# EAGLE design IRTHERMV2.1 (EAGLE 7.2.0)
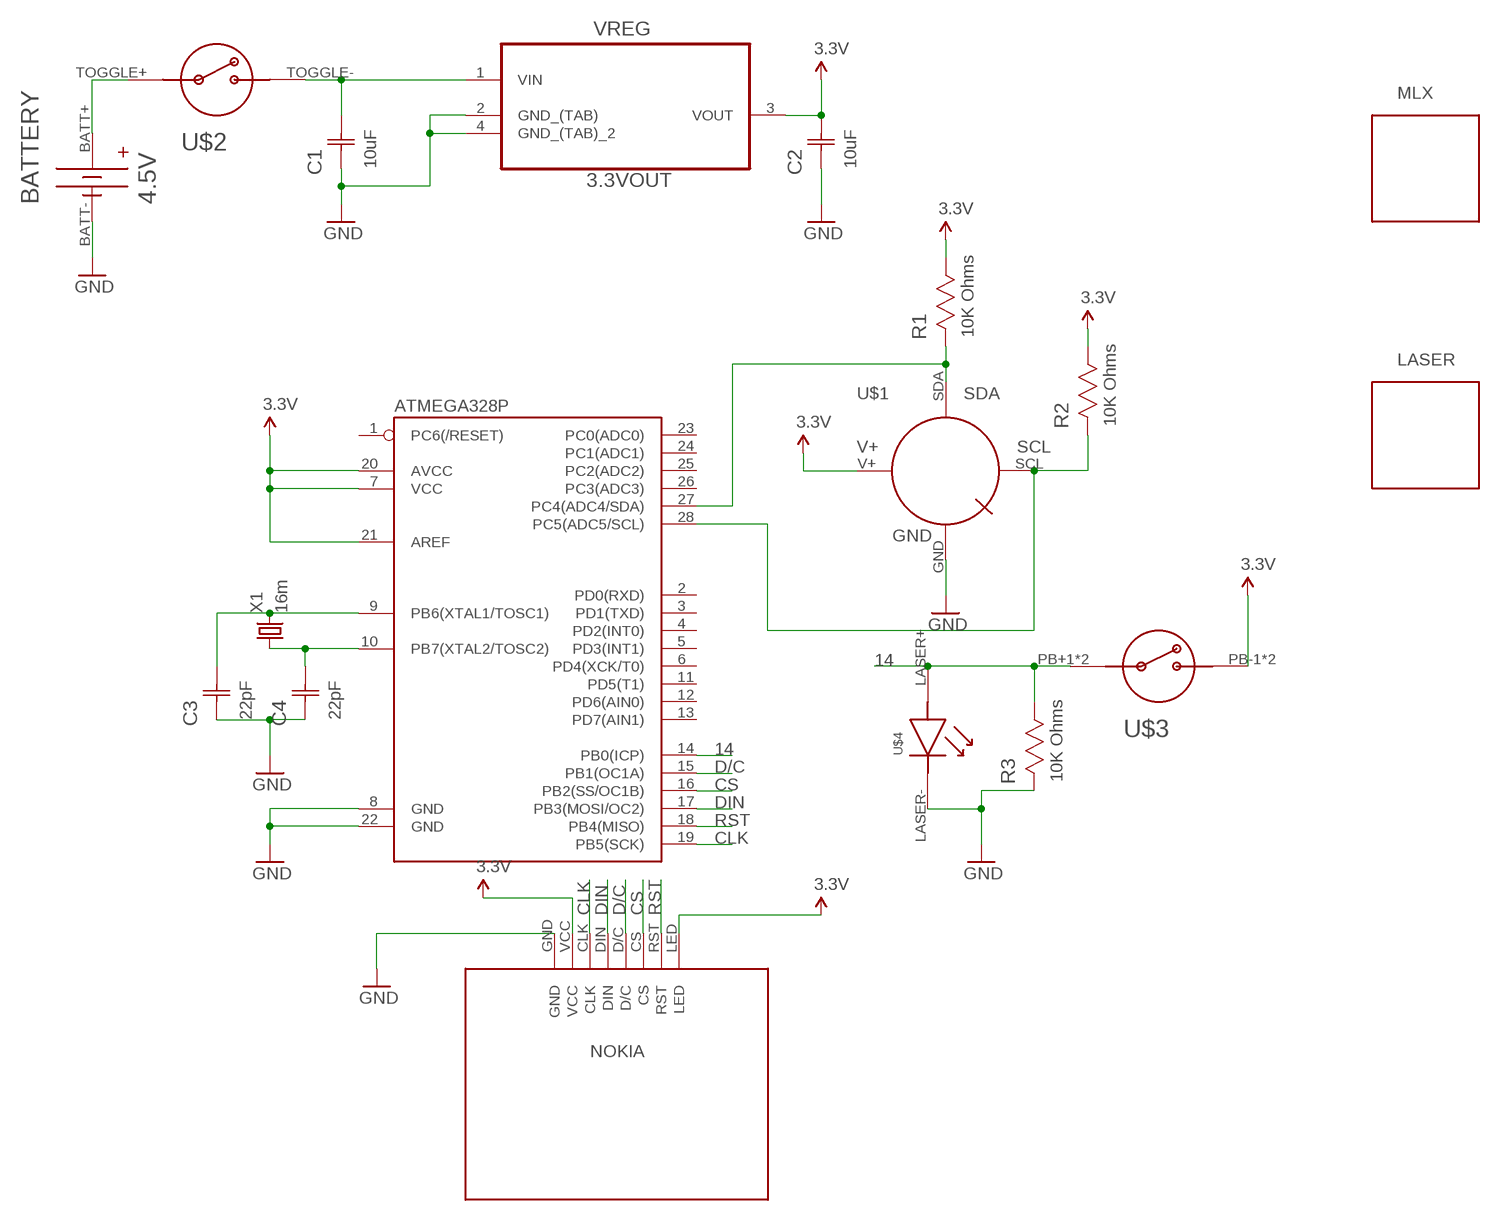
[diagram p0: schematic, sheet 1]

## Parts
ATMEGA328P  ATMEGA328P_PDIP  [DIL28-3]
BATTERY  4.5V  KEYSTONE2479  [KEYSTONE2479]
C1  10uF  C1206C106K4RACTU  [CAPC3216X180N]
C2  10uF  C1206C106K4RACTU  [CAPC3216X180N]
C3  22pF  C1206C220J5GACTU  [CAPC3216X88N]
C4  22pF  C1206C220J5GACTU  [CAPC3216X88N]
LASER  KEYSTONECLIP  [KEYSTONE50]
MLX  KEYSTONECLIP  [KEYSTONE50]
R1  10K Ohms  CRCW120610K0JNEA  [RESC3216X71N]
R2  10K Ohms  CRCW120610K0JNEA  [RESC3216X71N]
R3  10K Ohms  CRCW120610K0JNEA  [RESC3216X71N]
U$1  MLX90614  [MLX90614]
U$2  1683ON-OFFTOGGLE  [1683ON-OFFTOGGLE]
U$3  1009PUSHBUTTON  [1009PUSHBUTTON]
U$4  LASER  [LASER]
U$5  NOKIA  [NOKIA]
VREG  3.3VOUT  MCP1824ST-3302E/DB  [SOT230P700X180-4N]
X1  16m  CRYSTALHC49US  [HC49US]

## Nets
3.3V: ATMEGA328P.7(VCC) ATMEGA328P.20(AVCC) ATMEGA328P.21(AREF) C2.2(C2) R1.1 R2.1 U$1.V+(MLXV+) U$3.PB-1(ONOFF-) U$3.PB-2(ONOFF-) U$5.LED U$5.VCC VREG.3(VOUT)
14: ATMEGA328P.14(PB0(ICP)) R3.1 U$3.PB+1(ONOFF+) U$3.PB+2(ONOFF+) U$4.LASER+
CLK: ATMEGA328P.19(PB5(SCK)) U$5.CLK
CS: ATMEGA328P.16(PB2(SS/OC1B)) U$5.CS
D/C: ATMEGA328P.15(PB1(OC1A)) U$5.D/C
DIN: ATMEGA328P.17(PB3(MOSI/OC2)) U$5.DIN
GND: ATMEGA328P.8(GND) ATMEGA328P.22(GND) BATTERY.BATT- C1.1(C1) C2.1(C1) C3.1(C1) C4.1(C1) R3.2 U$1.GND(MLXGND) U$4.LASER-(LASERGND) U$5.GND VREG.2(GND_(TAB)) VREG.4(GND_(TAB)_2)
N$1: BATTERY.BATT+ U$2.TOGGLE+(ONOFF+)
N$2: C1.2(C2) U$2.TOGGLE-(ONOFF-) VREG.1(VIN)
N$5: ATMEGA328P.27(PC4(ADC4/SDA)) R1.2 U$1.SDA(MLXSDA)
N$6: ATMEGA328P.28(PC5(ADC5/SCL)) R2.2 U$1.SCL(MLXSCL)
N$8: ATMEGA328P.9(PB6(XTAL1/TOSC1)) C3.2(C2) X1.2
N$9: ATMEGA328P.10(PB7(XTAL2/TOSC2)) C4.2(C2) X1.1
RST: ATMEGA328P.18(PB4(MISO)) U$5.RST
Unconnected: ATMEGA328P.1(PC6(/RESET)) ATMEGA328P.2(PD0(RXD)) ATMEGA328P.3(PD1(TXD)) ATMEGA328P.4(PD2(INT0)) ATMEGA328P.5(PD3(INT1)) ATMEGA328P.6(PD4(XCK/T0)) ATMEGA328P.11(PD5(T1)) ATMEGA328P.12(PD6(AIN0)) ATMEGA328P.13(PD7(AIN1)) ATMEGA328P.23(PC0(ADC0)) ATMEGA328P.24(PC1(ADC1)) ATMEGA328P.25(PC2(ADC2)) ATMEGA328P.26(PC3(ADC3))

## Library data of the parts
ATMEGA328P = SparkFun-DigitalIC:ATMEGA328P_PDIP: uC used in the Arduino 32kb flash, 1k EEPROM, 2k SRAM This is the through-hole version of this chip.
BATTERY = IRTHERM:KEYSTONE2479
C1 C2 = Kemet_By_element14_Batch_1:C1206C106K4RACTU: CAPACITOR, 1206; MPN: C1206C106K4RACTU; OC_FARNELL: 1463368; OC_NEWARK: 70K9170; SUPPLIER: Kemet; TOLERANCE: ±10%; VOLTAGERATING: 16V
C3 C4 = Kemet_By_element14_Batch_1:C1206C220J5GACTU: CAPACITOR, 1206; MPN: C1206C220J5GACTU; OC_FARNELL: 1414717; OC_NEWARK: 70K9304; SUPPLIER: Kemet; TOLERANCE: ±5%; VOLTAGERATING: 50V
LASER MLX = IRTHERM:KEYSTONECLIP
R1-R3 = Vishay_By_element14_Batch_1:CRCW120610K0JNEA: RESISTOR, 1206; MPN: CRCW120610K0JNEA; OC_FARNELL: 1469655; OC_NEWARK: 42K4755; SUPPLIER: Vishay; TOLERANCE: ±5%; WATTAGE: 0.25W
U$1 = IRTHERM:MLX90614
U$2 = IRTHERM:1683ON-OFFTOGGLE
U$3 = IRTHERM:1009PUSHBUTTON
U$4 = IRTHERM:LASER
U$5 = IRTHERM:NOKIA
VREG = Microchip:MCP1824ST-3302E/DB: IC, LDO VOLT REG, 3.3V, 0.3A,; MPN: MCP1824ST-3302E/DB; OC_FARNELL: 1578379; OC_NEWARK: 05N1293; PACKAGE: SOT-223-3; SUPPLIER: Microchip
X1 = SparkFun-FreqCtrl:CRYSTAL: Various standard crystals. Proven footprints.

## Board
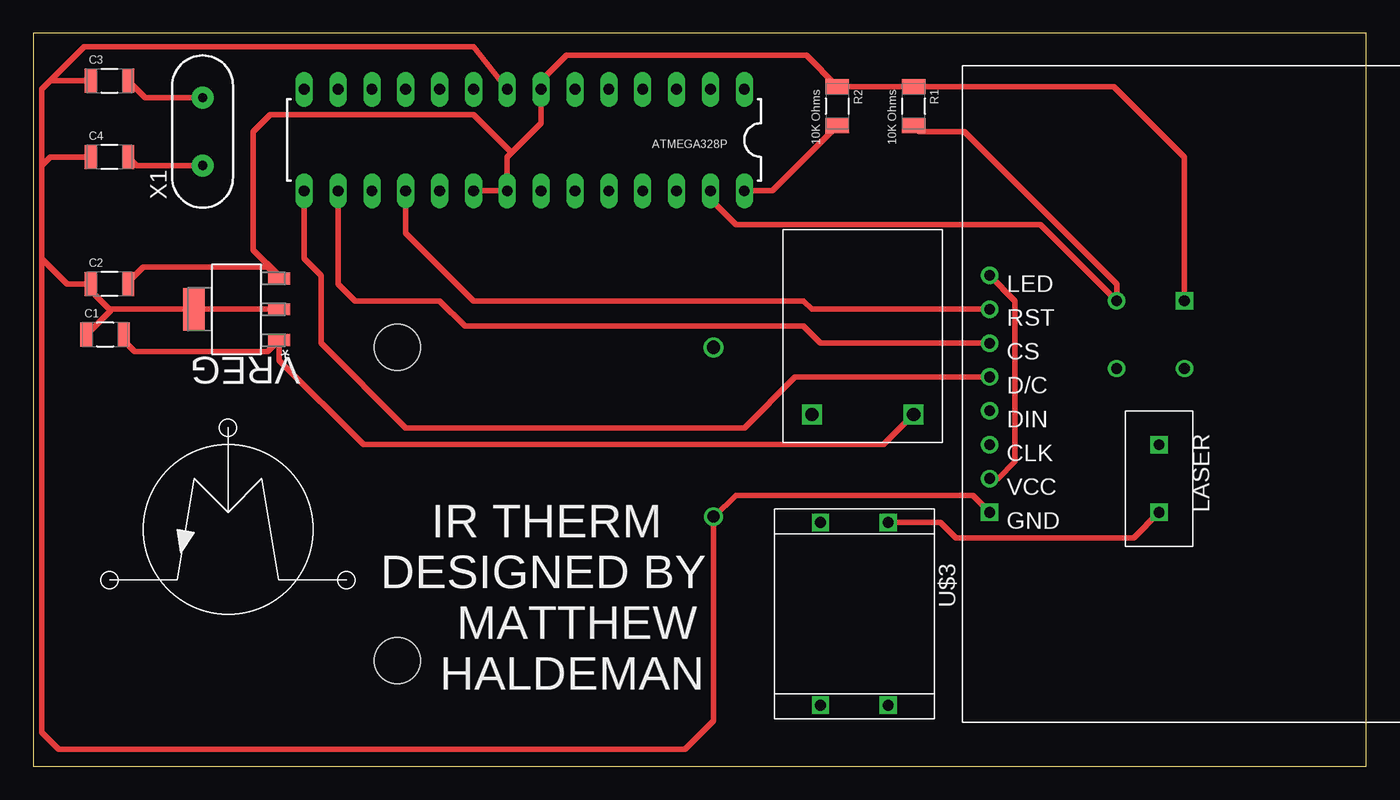
[diagram p1: board, top side]
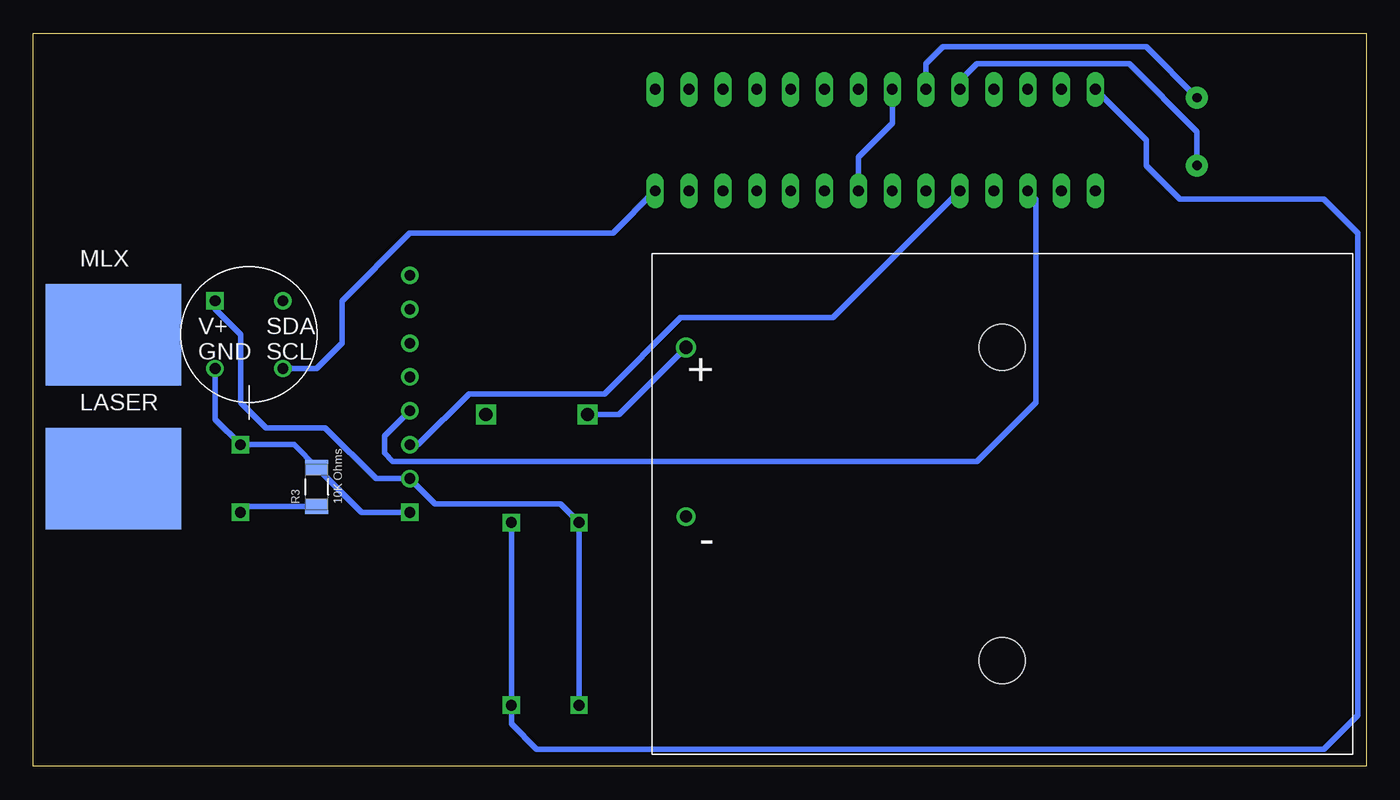
[diagram p2: board, bottom side, seen from below]

Size 100 x 55 mm. Coordinates in mm from the lower left corner, seen from the top.
Outline: 0,0 100,0 100,55 0,55 0,0
Copper layers (1*16): Top 0.035mm / dielectric 1.5mm / Bottom 0.035mm
Design rules "dirt_cheap_dirty_boards.v1": minimum track width 5mil, minimum drill 12mil, track to track 5mil, track to pad 5mil, pad to pad 5mil, via to via 5mil, smd to smd 0mil, copper to edge 10mil, drill to drill 10mil, minimum pad ring 10mil, minimum via ring 6mil, stop-mask expansion 2mil, vias tented up to drill 25mil, thermal gap 10mil

### Footprints (pad centres in the part's own frame; a part is rotated, then mirrored left to right if it is on the bottom)
DIL28-3 = drill 0.813 long: 1 -16.51,-3.81; 2 -13.97,-3.81; 3 -11.43,-3.81; 4 -8.89,-3.81; 5 -6.35,-3.81; 6 -3.81,-3.81; 7 -1.27,-3.81; 8 1.27,-3.81; 9 3.81,-3.81; 10 6.35,-3.81; 11 8.89,-3.81; 12 11.43,-3.81; 13 13.97,-3.81; 14 16.51,-3.81; 15 16.51,3.81; 16 13.97,3.81; 17 11.43,3.81; 18 8.89,3.81; 19 6.35,3.81; 20 3.81,3.81; 21 1.27,3.81; 22 -1.27,3.81; 23 -3.81,3.81; 24 -6.35,3.81; 25 -8.89,3.81; 26 -11.43,3.81; 27 -13.97,3.81; 28 -16.51,3.81
KEYSTONE2479 = drill 1: BATT+ 23.724,-11.748 | drill 0.9: BATT- 23.724,0.953 | hole 3.454: 0,11.748; 0,-11.748
CAPC3216X180N = smd 0.914 x 1.803: 1 -1.397,0; 2 1.397,0
CAPC3216X88N = smd 0.914 x 1.803: 1 -1.397,0; 2 1.397,0
KEYSTONE50 = smd 10.16 x 7.62: P$1 0,0
RESC3216X71N = smd 1.118 x 1.753: 1 -1.473,0; 2 1.473,0
MLX90614 = drill 0.8: GND -2.54,-2.54; SCL 2.54,-2.54; SDA 2.54,2.54 | drill 0.8 square: V+ -2.54,2.54
1683ON-OFFTOGGLE = drill 1 square: TOGGLE+ -3.81,-7.899; TOGGLE- 3.81,-7.899
1009PUSHBUTTON = drill 0.8 square: PB+1 -6.858,2.54; PB+2 6.858,2.54; PB-1 -6.858,-2.54; PB-2 6.858,-2.54
LASER = drill 0.8 square: LASER+ -2.54,0; LASER- 2.54,0
NOKIA = drill 0.8: CLK -3.81,19.05; CS 3.81,19.05; D/C 1.27,19.05; DIN -1.27,19.05; LED 8.89,19.05; RST 6.35,19.05; VCC -6.35,19.05 | drill 0.8 square: GND -8.89,19.05
SOT230P700X180-4N = smd 1.626 x 0.889: 1 -3.2,2.311; 2 -3.2,0; 3 -3.2,-2.311 | smd 1.626 x 3.175: 4 3.2,0
HC49US = drill 0.7 pad 1.651: 1 -2.54,0; 2 2.54,0

### Placement (x,y rotation side)
ATMEGA328P  36.83,46.99 180 top
BATTERY  27.3,19.68 180 bottom
C1  5.38,32.4 0 top
C2  5.71,36.2 0 top
C3  5.71,51.44 0 top
C4  5.71,45.72 0 top
LASER  93.98,21.59 0 bottom
MLX  93.98,32.38 0 bottom
R1  66.04,49.53 270 top
R2  60.33,49.53 270 top
R3  78.74,20.95 90 bottom
U$1  83.82,32.38 0 bottom
U$2  62.23,34.29 0 top
U$3  61.59,11.43 270 top
U$4  84.45,21.59 90 top
U$5  90.81,27.94 90 top
U$6  [SYMBOL]  14.61,17.78 0 top
VREG  15.24,34.29 180 top
X1  12.7,47.62 90 top

### Tracks (layer width: path | path; a pad name or v marks a point on that pad's centre or on a via)
3.3V
  Top 0.406: C2.2 7.11,36.32 8.26,37.47 17.58,37.47 VREG.3 18.44,36.8 16.51,38.73 16.51,47.62 17.78,48.9 33.02,48.9 35.88,46.04 | U$5.VCC 72.39,21.59 73.66,22.86 73.66,34.92 U$5.LED | 35.88,46.04 38.1,48.26 ATMEGA328P.7 38.1,51.44 40.01,53.34 57.99,53.34 R2.1 R1.1 81.08,51 86.36,45.72 U$1.V+ | 35.88,46.04 35.56,45.72 ATMEGA328P.21 ATMEGA328P.20
  Bottom 0.406: U$3.PB-2 U$3.PB-1 60.45,19.68 69.85,19.68 U$5.VCC 74.3,21.59 78.11,25.4 82.55,25.4 84.45,27.3 84.45,32.38 86.36,34.29 U$1.V+
14
  Top 0.406: U$3.PB+1 68.07,18.29 69.22,17.14 82.55,17.14 U$4.LASER+
  Bottom 0.406: ATMEGA328P.14 16.51,46.99 16.51,45.09 13.97,42.55 3.17,42.55 0.64,40.01 0.64,3.81 3.17,1.27 62.23,1.27 64.14,3.17 U$3.PB+2 U$3.PB+1 | R3.1 84.02,19.48 U$4.LASER+
CLK
  Bottom 0.406: U$5.CLK 71.12,24.13 67.31,27.94 57.15,27.94 51.44,33.66 40.01,33.66 ATMEGA328P.19
CS
  Top 0.406: ATMEGA328P.16 22.86,36.2 24.13,34.92 30.48,34.92 32.38,33.02 57.78,33.02 59.05,31.75 U$5.CS
D/C
  Top 0.406: U$5.D/C 57.15,29.21 53.34,25.4 27.94,25.4 21.59,31.75 21.59,36.83 20.32,38.1 ATMEGA328P.15
DIN
  Bottom 0.406: U$5.DIN 73.66,24.77 73.66,23.5 73.03,22.86 29.21,22.86 24.77,27.3 24.77,42.55 ATMEGA328P.17
GND
  Top 0.406: VREG.2 VREG.4 5.88,34.29 5.8,34.21 | 5.8,34.21 C1.1 | 5.8,34.21 4.32,35.69 C2.1 2.54,36.2 0.64,38.1 | 0.64,38.1 0.64,45.09 | 0.64,45.09 0.64,50.8 1.27,51.44 | 1.27,51.44 3.81,53.98 33.02,53.98 ATMEGA328P.8 | C3.1 1.27,51.44 | C4.1 1.27,45.72 0.64,45.09 | U$5.GND 70.48,20.32 52.7,20.32 51.12,18.73 BATTERY.BATT- 51.03,3.4 48.9,1.27 1.91,1.27 0.64,2.54 0.64,38.1
  Bottom 0.406: ATMEGA328P.8 35.56,48.26 38.1,45.72 ATMEGA328P.22 | U$5.GND 75.36,19.05 R3.2 80.44,24.13 U$4.LASER- 86.36,26.04 U$1.GND
N$1
  Bottom 0.406: BATTERY.BATT+ 56.07,26.39 U$2.TOGGLE+
N$2
  Top 0.406: U$2.TOGGLE- 63.78,24.13 24.77,24.13 18.44,30.45 VREG.1 17.58,31.11 7.62,31.11 6.78,31.95 C1.2
N$5
  Top 0.406: ATMEGA328P.27 50.8,42.55 52.7,40.64 75.56,40.64 U$1.SDA 81.28,36.2 69.85,47.62 66.47,47.62 R1.2
N$6
  Top 0.406: ATMEGA328P.28 55.45,43.18 R2.2
  Bottom 0.406: U$1.SCL 78.74,29.84 76.83,31.75 76.83,34.92 71.75,40.01 56.52,40.01 ATMEGA328P.28
N$8
  Top 0.406: X1.2 8.38,50.16 C3.2
  Bottom 0.406: ATMEGA328P.9 33.02,52.7 31.75,53.98 16.51,53.98 X1.2
N$9
  Top 0.406: X1.1 7.75,45.09 C4.2
  Bottom 0.406: ATMEGA328P.10 30.48,51.44 29.21,52.7 17.78,52.7 12.7,47.62 X1.1
RST
  Top 0.406: U$5.RST 58.42,34.29 57.78,34.92 33.02,34.92 27.94,40.01 ATMEGA328P.18

### Text on the board
tPlace: IR THERM | DESIGNED BY | MATTHEW | HALDEMAN